# Altium project FMC_DAC_125M_14B_16CHA.PrjPCB (part 2 of 4)

## Sheet power_supply.SchDoc: Shuttler
size 420 x 297 mm; Author: G.Kasprowicz; CompanyName: WUT ISE; DrawnBy: G.Kasprowicz; Organization: WUT ISE; Address1: PW ISE; Address2: Nowowiejska 15/19 00-665 Warsaw; Address3: gkasprow@gmail.com; DocumentNumber: 8; Revision: 1.2; SheetNumber: 8; SheetTotal: 10; ModifiedBy: -; CheckedDate: -; Title2: Power supply; DivGrp: WUT ISE; Designer: G.Kasprowicz; ModifiedDate: -; ProjectName: Sensor Box
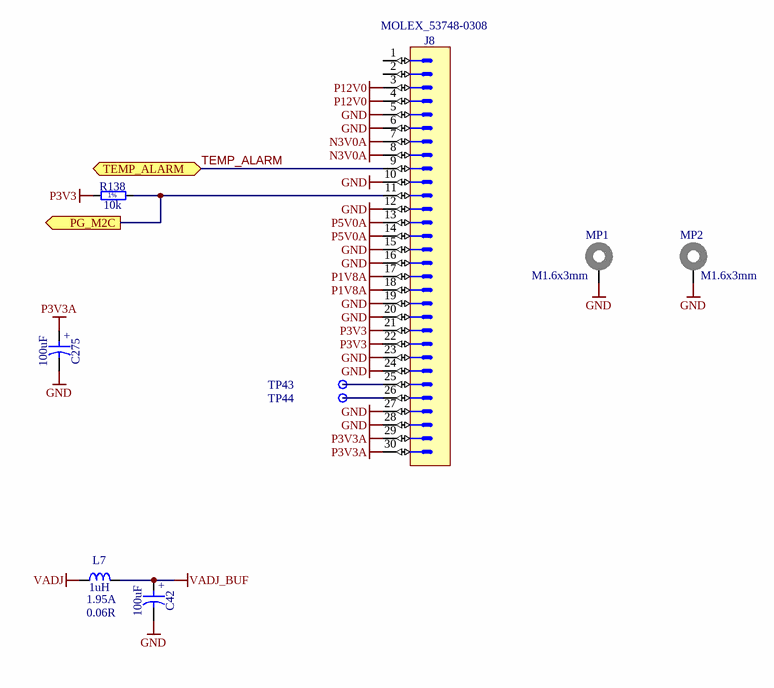
[diagram p3: power_supply.SchDoc]

### Parts
C42  100uF  [CAPMP3216X180N]
C275  100uF  [CAPMP3216X180N]
J8  SlimStack™  [MOLEX_53748-0308]  (value not drawn)
L7  1uH  Power: 1.95A  Resistance: 0.06R  [INDC2620X100N]
MP1  M1.6x3mm  [9774030633]
MP2  M1.6x3mm  [9774030633]
R138  10k  [RESC1005X40N]
TP43  Test Point  [TPS127]  (value not drawn)  (no BOM)
TP44  Test Point  [TPS127]  (value not drawn)  (no BOM)

### Ports
PG_M2C (out), TEMP_ALARM (bidir)

### Nets
GND: C42.2 C275.2 J8.5 J8.6 J8.10 J8.12 J8.15 J8.16 J8.19 J8.20 J8.23 J8.24 J8.27 J8.28 MP1.1 MP2.1
N3V0A: J8.7 J8.8
P1V8A: J8.17 J8.18
P3V3: J8.21 J8.22 R138.1
P3V3A: C275.1 J8.29 J8.30
P5V0A: J8.13 J8.14
P12V0: J8.3 J8.4
VADJ: L7.1
VADJ_BUF: C42.1 L7.2
PG_M2C: J8.11 R138.2 ; port PG_M2C
TEMP_ALARM: J8.9 ; port TEMP_ALARM
NetJ8_25: J8.25 TP43.1
NetJ8_26: J8.26 TP44.1

Not connected (* = marked no-connect by the designer): J8 1 2

### Notes on the sheet
- Project/Equipment
- Document
- Designer
- Drawn by
- Check.by
- Copyright WUT ISE 2018.
  This documentation describes Open Hardware and is licensed under the CERN OHL v.1.1. You may redistribute and modify this documentation under the terms of the CERN OHL v.1.1. (http://ohwr.org/CERNOHL). This documentation is distributed WITHOUT ANY EXPRESS OR IMPLIED WARRANTY, INCLUDING OF MERCHANTABILITY, SATISFACTORY QUALITY AND FITNESS FOR A PARTICULAR PURPOSE. Please see the CERN OHL v.1.1 for applicable conditions.
- Contact
- File
- Last Mod.
- Print Date
- Sheet
- Size
- A3
- of
- Rev
- (in symbol CTE3216-18_100UF_6.3V_20%_ESR0500_AVX_TLJ) +
- (in symbol R0402_10K_1%_0.0625W_100PPM) 1%

### Library data of the parts
C42 C275 = CTE3216-18_100UF_6.3V_20%_ESR0500_AVX_TLJ: Polarised capacitor; Part Description: ESR 0R5 Solid Tantalum Chip Capacitor; Manufacturer: AVX; Manufacturer Part Number: TLJA107M006R0500; Voltage: 6.3V; Tolerance: ±20%; Part Number: CTE3216-18_100UF_6.3V_20%_ESR0500_AVX_TLJ; Component Kind: Standard; Component Type: Standard; Pin Count: 2; Value: 100uF; Status: None; Case: A; Mounted: Yes; Socket: No; SMD: Yes; Sense: No; HelpURL: \\cern.ch\dfs\Applications\Altium\Datasheets\CTE_AVX_TLJ.pdf; Author: CERN DEM JLC; CreateDate: 19.12.2013; LatestRevisionDate: 19.12.2013; ComponentHeight: 1.8mm
J8 = MOLEX_53748-0308: Connector 30 Male; Part Description: 0.50mm Pitch SlimStack™ Dual Row 30 Circuits Surface Mount Vertical Plug (3.00 Stacking Heights); Manufacturer: MOLEX; PressFit: No; Part Number: MOLEX_53748-0308; Component Kind: Standard; Component Type: Standard; Pin Count: 30; Family: SlimStack™; Mounted: Yes; Socket: No; SMD: Yes; Sense: No; Status: None; Manufacturer Part Number: 53748-0308; ComponentHeight: 2.4mm; HelpURL: \\cern.ch\dfs\Applications\Altium\Datasheets\MOLEX_53748-0308.pdf; Author: CERN DEM JLC; CreateDate: 28.08.2012; LatestRevisionDate: 28.08.2012
L7 = IND1008_1UH_20%_WURTH_74479787210B: Inductor; Part Description: Power Multilayer Inductor (WE-PMI Series); Manufacturer: WURTH ELEKTRONIK; Tolerance: ±20%; Part Number: IND1008_1UH_20%_WURTH_74479787210B; Component Kind: Standard; Component Type: Standard; Pin Count: 2; Value: 1uH; Status: None; Manufacturer Part Number: 74479787210B; Mounted: Yes; Socket: No; SMD: Yes; Sense: No; ComponentHeight: 1mm; HelpURL: \\cern.ch\dfs\Applications\Altium\Datasheets\IND_WURTH_WE-PMI_74479787210B.pdf; Author: CERN DEM JLC; CreateDate: 01.10.2014; LatestRevisionDate: 01.10.2014; Case: 1008
MP1 MP2 = 9774030633R: WA-SMSI SMT Steel Spacer, M1.6 Thread Internal, OD 3.3mm, M1.6x3mm; Manufacturer: Wurth Elektronik; Inner Diameter: 1.9mm; Surface: Tin; ComponentLink1Description: Manufacturer; ComponentLink1URL: http://www.we-online.de; ComponentLink2Description: Datasheet; ComponentLink2URL: https://www.we-online.com/catalog/datasheet/9774030633R.pdf; Mounting Technology: SMT; Packaging: Tape and Reel; Manufacturer Part Number: 9774030633R; Length: 3mm; Inner Thread Length: -; Operating Temperature: -55 to +150degC; Outer Diameter: 3.3mm; Published Date: April 2020; Material: Steel; Thread: M1.6
R138 = R0402_10K_1%_0.0625W_100PPM: Resistor - 1%; Part Description: General Purpose Thick Film Chip Resistor; Manufacturer: GENERIC; Manufacturer1 Part Number: 232270671003L; TC: ±100ppm/°C; PressFit: No; Part Number: R0402_10K_1%_0.0625W_100PPM; Component Kind: Standard; Component Type: Standard; Pin Count: 2; Value: 10k; Status: Not Recommended; Power: 0.0625W; Tolerance: ±1%; Manufacturer Part Number: R0402_10K_1%_0.0625W_100PPM; Case: 0402; Mounted: Yes; Sense: No; Socket: No; SMD: Yes; Manufacturer1 Example: YAGEO PHYCOMP; Manufacturer1 ComponentHeight: 0.4mm; HelpURL: \\cern.ch\dfs\Applications\Altium\Datasheets\R0402_Phycomp_RC0402.pdf; Author: CERN DEM JLC; CreateDate: 03.12.2007; LatestRevisionDate: 17.10.2012
TP43 TP44 = SMD_PAD_1.27X1.27MM: Part Description: 1.27mm x 1.27mm PCB Copper Area (SMD Test Point); Mounted: No; Part Number: SMD_PAD_1.27X1.27MM; Component Type: Standard (No BOM); Pin Count: 1; Family: Test Point; Socket: No; SMD: Yes; Sense: No; Status: None; ComponentHeight: 0mm; HelpURL: Undefined; Author: CERN DEM JLC; CreateDate: 12.01.2008; LatestRevisionDate: 12.01.2008; PackageDescription: 1.27mm x 1.27mm PCB Copper Area (SMD Test Point)

## Sheet SAS_Connectors.SchDoc: Shuttler
size 420 x 297 mm; Author: G.Kasprowicz; CompanyName: WUT ISE; DrawnBy: G.Kasprowicz; Organization: WUT ISE; Address1: PW ISE; Address2: Nowowiejska 15/19 00-665 Warsaw; Address3: gkasprow@gmail.com; DocumentNumber: 10; Revision: 1.2; SheetNumber: 10; SheetTotal: 10; ModifiedBy: -; CheckedDate: -; Title2: SAS connectors; DivGrp: WUT ISE; Designer: G.Kasprowicz; ModifiedDate: -; ProjectName: Sensor Box
Used 2 times, as channels U_SAS_Connectors0, U_SAS_Connectors1. Parts and nets are listed once, with the designators drawn on the sheet.
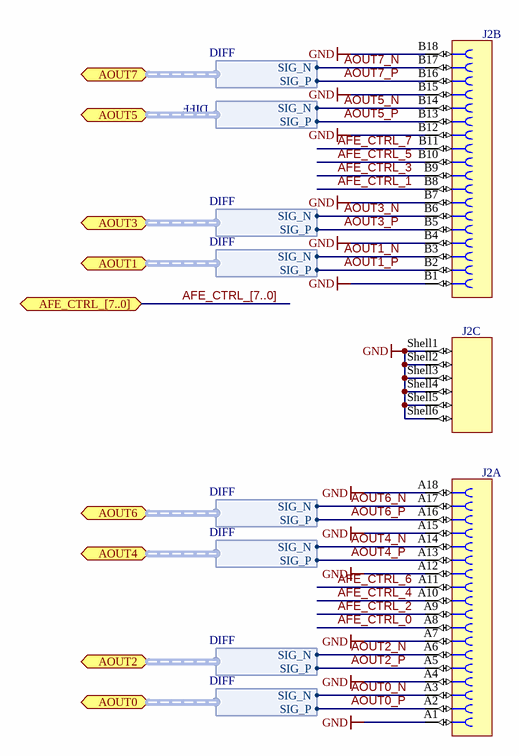
[diagram p4: SAS_Connectors.SchDoc]

### Parts
J2  iPass™  [MOLEX_75783-0107]  (value not drawn)  (parts A,B,C of 3)

### Ports
AFE_CTRL_[7..0] (bidir), AOUT0 (bidir, harness DIFF), AOUT1 (bidir, harness DIFF), AOUT2 (bidir, harness DIFF), AOUT3 (bidir, harness DIFF), AOUT4 (bidir, harness DIFF), AOUT5 (bidir, harness DIFF), AOUT6 (bidir, harness DIFF), AOUT7 (bidir, harness DIFF)

### Harnesses
DIFF: SIG_P, SIG_N

### Nets
GND: J2.A1 J2.A4 J2.A7 J2.A12 J2.A15 J2.A18 J2.B1 J2.B4 J2.B7 J2.B12 J2.B15 J2.B18 J2.Shell1 J2.Shell2 J2.Shell3 J2.Shell4 J2.Shell5 J2.Shell6
AFE_CTRL_0: J2.A8
AFE_CTRL_1: J2.B8
AFE_CTRL_2: J2.A9
AFE_CTRL_3: J2.B9
AFE_CTRL_4: J2.A10
AFE_CTRL_5: J2.B10
AFE_CTRL_6: J2.A11
AFE_CTRL_7: J2.B11
AOUT0_N: J2.A3 ; port AOUT0.SIG_N
AOUT0_P: J2.A2 ; port AOUT0.SIG_P
AOUT1_N: J2.B3 ; port AOUT1.SIG_N
AOUT1_P: J2.B2 ; port AOUT1.SIG_P
AOUT2_N: J2.A6 ; port AOUT2.SIG_N
AOUT2_P: J2.A5 ; port AOUT2.SIG_P
AOUT3_N: J2.B6 ; port AOUT3.SIG_N
AOUT3_P: J2.B5 ; port AOUT3.SIG_P
AOUT4_N: J2.A14 ; port AOUT4.SIG_N
AOUT4_P: J2.A13 ; port AOUT4.SIG_P
AOUT5_N: J2.B14 ; port AOUT5.SIG_N
AOUT5_P: J2.B13 ; port AOUT5.SIG_P
AOUT6_N: J2.A17 ; port AOUT6.SIG_N
AOUT6_P: J2.A16 ; port AOUT6.SIG_P
AOUT7_N: J2.B17 ; port AOUT7.SIG_N
AOUT7_P: J2.B16 ; port AOUT7.SIG_P

### Channels
U_SAS_Connectors0: designators end in A
U_SAS_Connectors1: designators end in B

### Buses and harness runs
bus AFE_CTRL_[7..0] = port AFE_CTRL_[7..0]

### Notes on the sheet
- Project/Equipment
- Document
- Designer
- Drawn by
- Check.by
- Copyright WUT ISE 2018.
  This documentation describes Open Hardware and is licensed under the CERN OHL v.1.1. You may redistribute and modify this documentation under the terms of the CERN OHL v.1.1. (http://ohwr.org/CERNOHL). This documentation is distributed WITHOUT ANY EXPRESS OR IMPLIED WARRANTY, INCLUDING OF MERCHANTABILITY, SATISFACTORY QUALITY AND FITNESS FOR A PARTICULAR PURPOSE. Please see the CERN OHL v.1.1 for applicable conditions.
- Contact
- File
- Last Mod.
- Print Date
- Sheet
- Size
- A3
- of
- Rev

### Library data of the parts
J2 = MOLEX_75783-0107: 36 Circuit, Right Angle , Internal Assembly, iPass™ I/O Surface Mount Receptacle with Left Key Shell; Part Number: MOLEX 75783-0107 / 75783-0136; Manufacturer: MOLEX; Manufacturer Part Number: 75783-0107 / 75783-0136; PressFit: No; Component Kind: Standard; Component Type: Standard; Pin Count: 42; Family: iPass™; Mounted: Yes; Socket: No; SMD: Yes; Sense: No; Status: None; Part Description: 36 Circuit, Right Angle , Internal Assembly, iPass™ I/O Surface Mount Receptacle with Left Key Shell; ComponentHeight: 8.47mm; HelpURL: \\cern.ch\dfs\Applications\Altium\Datasheets\MOLEX_75783-0107.pdf; Author: CERN DEM JLC; CreateDate: 12.11.2014; LatestRevisionDate: 12.11.2014

## Sheet DAC_AFE.SchDoc: Shuttler
size 420 x 297 mm; Author: G.Kasprowicz; CompanyName: WUT ISE; DrawnBy: G.Kasprowicz; Organization: WUT ISE; Address1: PW ISE; Address2: Nowowiejska 15/19 00-665 Warsaw; Address3: gkasprow@gmail.com; DocumentNumber: 4; Revision: 1.2; SheetNumber: 4; SheetTotal: 10; ModifiedBy: -; CheckedDate: -; Title2: DAC AFE; DivGrp: WUT ISE; Designer: G.Kasprowicz; ModifiedDate: -; ProjectName: Sensor Box
Used 16 times, as channels U_DAC_AFE0, U_DAC_AFE1, U_DAC_AFE2, U_DAC_AFE3, U_DAC_AFE4, U_DAC_AFE5, U_DAC_AFE6, U_DAC_AFE7, U_DAC_AFE8, U_DAC_AFE9, U_DAC_AFE10, U_DAC_AFE11, U_DAC_AFE12, U_DAC_AFE13, U_DAC_AFE14, U_DAC_AFE15. Parts and nets are listed once, with the designators drawn on the sheet.
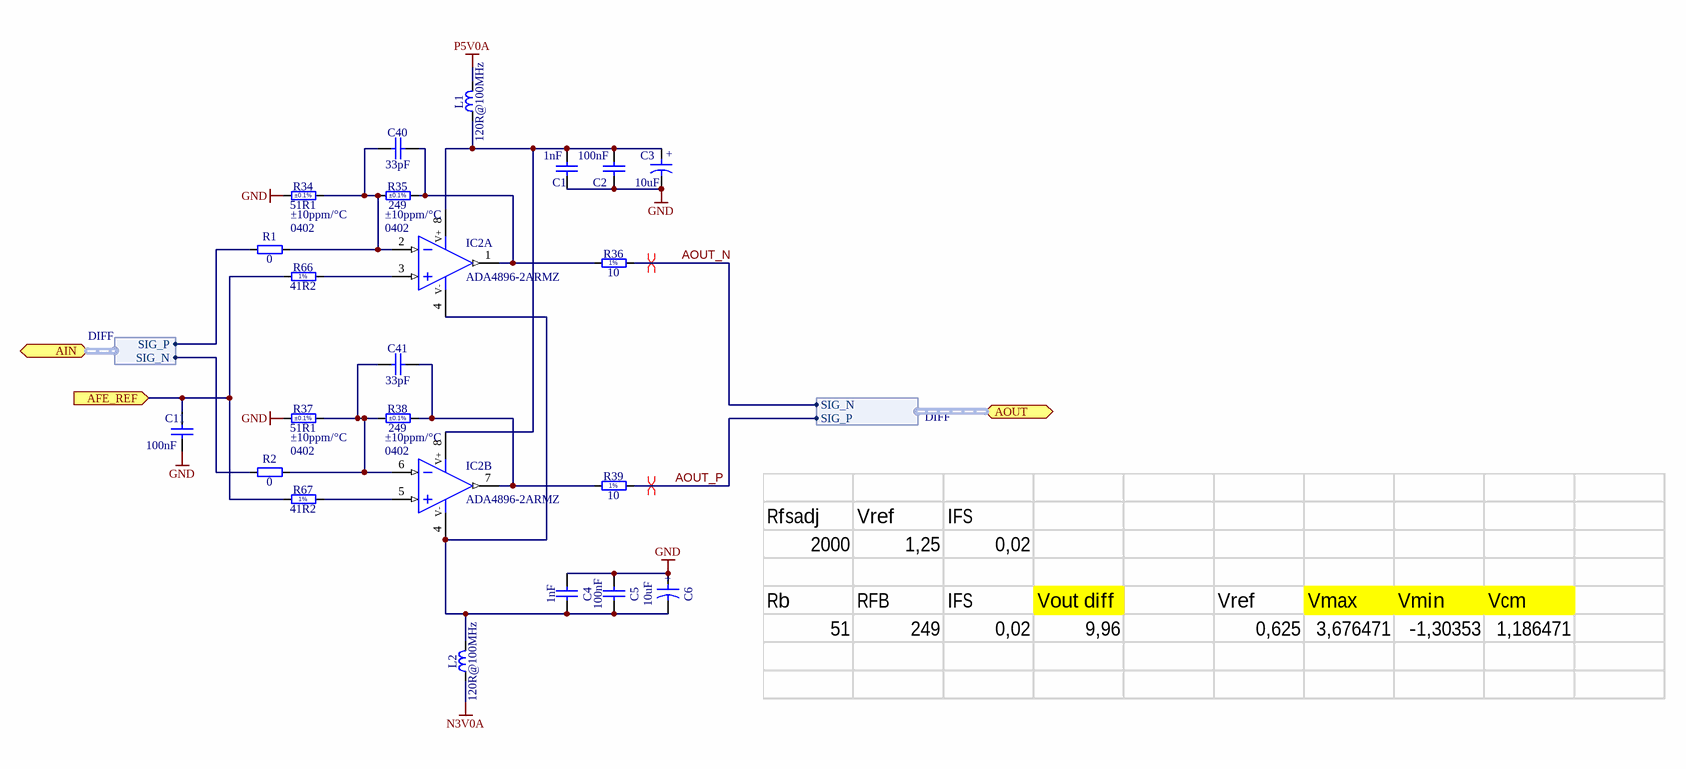
[diagram p5: DAC_AFE.SchDoc]

### Parts
C1  1nF  [CAPC0603X33N]
C2  100nF  [CAPC0603X33N]
C3  10uF  [CAPMP3216X180N]
C4  1nF  [CAPC0603X33N]
C5  100nF  [CAPC0603X33N]
C6  10uF  [CAPMP3216X180N]
C11  100nF  [CAPC0603X33N]
C40  33pF  [CAPC1005X61N]
C41  33pF  [CAPC1005X61N]
IC2  ADA4896-2ARMZ  [SOP65P490X110-8N]  (parts A,B of 2)
L1  120R@100MHz  [INDC1608X95N]
L2  120R@100MHz  [INDC1608X95N]
R1  0  [RESC0603X28N]
R2  0  [RESC0603X28N]
R34  51R1  TC: ±10ppm/°C  Case: 0402  Tolerance: ±0.1%  [RESC1005X35N]
R35  249  TC: ±10ppm/°C  Case: 0402  Tolerance: ±0.1%  [RESC1005X35N]
R36  10  [RESC1005X40N]
R37  51R1  TC: ±10ppm/°C  Case: 0402  Tolerance: ±0.1%  [RESC1005X35N]
R38  249  TC: ±10ppm/°C  Case: 0402  Tolerance: ±0.1%  [RESC1005X35N]
R39  10  [RESC1005X40N]
R66  41R2  [RESC0603X28N]
R67  41R2  [RESC0603X28N]

### Ports
AFE_REF (in), AIN (bidir, harness DIFF), AOUT (bidir, harness DIFF)

### Harnesses
DIFF: SIG_P, SIG_N

### Nets
GND: C1.2 C2.2 C3.2 C4.2 C5.2 C6.1 C11.2 R34.1 R37.1
N3V0A: L2.1
P5V0A: L1.2
AFE_REF: C11.1 R66.1 R67.1 ; port AFE_REF
AOUT_N: R36.2 ; port AOUT.SIG_N
AOUT_P: R39.2 ; port AOUT.SIG_P
NetC1_1: C1.1 C2.1 C3.1 IC2.8(V+) L1.1
NetC4_1: C4.1 C5.1 C6.2 IC2.4(V-) L2.2
NetC40_1: C40.1 IC2.2(IN-) R1.2 R34.2 R35.1
NetC40_2: C40.2 IC2.1(OUT) R35.2 R36.1
NetC41_1: C41.1 IC2.6(IN-) R2.2 R37.2 R38.1
NetC41_2: C41.2 IC2.7(OUT) R38.2 R39.1
NetIC2_3: IC2.3(IN+) R66.2
NetIC2_5: IC2.5(IN+) R67.2
NetR1_1: R1.1 ; port AIN.SIG_P
NetR2_1: R2.1 ; port AIN.SIG_N

### Channels
U_DAC_AFE0: designators end in A; ports AFE_REF=AFE_REF
U_DAC_AFE1: designators end in B; ports AFE_REF=AFE_REF
U_DAC_AFE2: designators end in C; ports AFE_REF=AFE_REF
U_DAC_AFE3: designators end in D; ports AFE_REF=AFE_REF
U_DAC_AFE4: designators end in E; ports AFE_REF=AFE_REF
U_DAC_AFE5: designators end in F; ports AFE_REF=AFE_REF
U_DAC_AFE6: designators end in G; ports AFE_REF=AFE_REF
U_DAC_AFE7: designators end in H; ports AFE_REF=AFE_REF
U_DAC_AFE8: designators end in I; ports AFE_REF=AFE_REF
U_DAC_AFE9: designators end in J; ports AFE_REF=AFE_REF
U_DAC_AFE10: designators end in K; ports AFE_REF=AFE_REF
U_DAC_AFE11: designators end in L; ports AFE_REF=AFE_REF
U_DAC_AFE12: designators end in M; ports AFE_REF=AFE_REF
U_DAC_AFE13: designators end in N; ports AFE_REF=AFE_REF
U_DAC_AFE14: designators end in O; ports AFE_REF=AFE_REF
U_DAC_AFE15: designators end in P; ports AFE_REF=AFE_REF

### Layout directives
differential pair; differential pair class V_analog: AOUT0_N, AOUT0_P

### Notes on the sheet
- Project/Equipment
- Document
- Designer
- Drawn by
- Check.by
- Copyright WUT ISE 2018.
  This documentation describes Open Hardware and is licensed under the CERN OHL v.1.1. You may redistribute and modify this documentation under the terms of the CERN OHL v.1.1. (http://ohwr.org/CERNOHL). This documentation is distributed WITHOUT ANY EXPRESS OR IMPLIED WARRANTY, INCLUDING OF MERCHANTABILITY, SATISFACTORY QUALITY AND FITNESS FOR A PARTICULAR PURPOSE. Please see the CERN OHL v.1.1 for applicable conditions.
- Contact
- File
- Last Mod.
- Print Date
- Sheet
- Size
- A3
- of
- Rev
- (in symbol CTE3216-18_10UF_10V_10%_LESR1800) +
- (in symbol R0402_10R_1%_0.0625W_200PPM) 1%
- (in symbol RES_0201_41R2_1%_200ppm) 1%

### Library data of the parts
C1 C4 = CC0201_1NF_16V_10%_X5R: Non-polarised capacitor; Part Description: SMD Multilayer Chip Ceramic Capacitor; Manufacturer: GENERIC; Manufacturer1 Part Number: 0201YD102KAT2A; Voltage: 16V; TC: X5R; Tolerance: ±10%; Part Number: CC0201_1NF_16V_10%_X5R; Component Kind: Standard; Component Type: Standard; Pin Count: 2; Value: 1nF; Status: Not Recommended; Manufacturer Part Number: CC0201_1NF_16V_10%_X5R; Case: 0201; Mounted: Yes; Socket: No; SMD: Yes; Sense: No; Manufacturer1 Example: AVX; Manufacturer1 ComponentHeight: 0.33mm; HelpURL: \\cern.ch\dfs\Applications\Altium\Datasheets\CC0201_X5R_AVX.pdf; Author: CERN DEM JLC; CreateDate: 03.12.2007; LatestRevisionDate: 03.12.2007
C2 C5 C11 = CC0201_100NF_6.3V_10%_X5R: Non-polarised capacitor; Part Description: SMD Multilayer Chip Ceramic Capacitor; Manufacturer: GENERIC; Manufacturer1 Part Number: 02016D104KAT2A; Voltage: 6.3V; TC: X5R; Tolerance: ±10%; Part Number: CC0201_100NF_6.3V_10%_X5R; Component Kind: Standard; Component Type: Standard; Pin Count: 2; Value: 100nF; Status: Not Recommended; Manufacturer Part Number: CC0201_100NF_6.3V_10%_X5R; Case: 0201; Mounted: Yes; Socket: No; SMD: Yes; Sense: No; Manufacturer1 Example: AVX; Manufacturer1 ComponentHeight: 0.33mm; HelpURL: \\cern.ch\dfs\Applications\Altium\Datasheets\CC0201_X5R_AVX.pdf; Author: CERN DEM JLC; CreateDate: 03.12.2007; LatestRevisionDate: 03.12.2007
C3 C6 = CTE3216-18_10UF_10V_10%_LESR1800: Polarised capacitor; Part Description: Low ESR 1R8 Solid Tantalum Chip Capacitor; Manufacturer: GENERIC; Manufacturer1 Part Number: TPSA106K010R1800; Voltage: 10V; Tolerance: ±10%; Part Number: CTE3216-18_10UF_10V_10%_LESR1800; Component Kind: Standard; Component Type: Standard; Pin Count: 2; Value: 10uF; Status: Preferred; Manufacturer Part Number: CTE3216-18_10UF_10V_10%_LESR1800; Case: A; Mounted: Yes; Socket: No; SMD: Yes; Sense: No; Manufacturer1 Example: AVX; Manufacturer1 ComponentHeight: 1.8mm; HelpURL: \\cern.ch\dfs\Applications\Altium\Datasheets\CTE-LESR_AVX_TPS.pdf; Author: CERN DEM JLC; CreateDate: 05.05.2008; LatestRevisionDate: 20.01.2009
C40 C41 = CC0402_33PF_50V_1%_NP0_JOHANSON_R07S: Non-polarised capacitor; Part Description: Ultra High-Q SMD Multilayer Capacitor; Manufacturer: JOHANSON TECHNOLOGY; Manufacturer Part Number: 500R07S330FV4T; Voltage: 50V; TC: C0G/NP0; Tolerance: ±1%; Part Number: CC0402_33PF_50V_1%_NP0_JOHANSON_R07S; Component Kind: Standard; Component Type: Standard; Pin Count: 2; Value: 33pF; Status: Not Recommended; Case: 0402; Mounted: Yes; Socket: No; SMD: Yes; Sense: No; ComponentHeight: 0.61mm; HelpURL: \\cern.ch\dfs\Applications\Altium\Datasheets\CC0402_NP0_JOHANSON_R07S.pdf; Author: CERN DEM BC; CreateDate: 20.11.2017; LatestRevisionDate: 26.09.2018
IC2 = ADA4896-2ARMZ: Dual Operational Amplifier; Part Description: 1 nV/sqrt Hz, Low Power, Rail-to-Rail Output Amplifiers; Manufacturer: ANALOG DEVICES; PressFit: No; Bonding: No; Part Number: ADA4896-2ARMZ; Component Kind: Standard; Component Type: Standard; Device: ADA4896-2ARMZ; PackageDescription: SOP, 0.65mm Pitch; 8 Pin, 3.00mm W X 3.00mm L X 1.10mm H body, IPC Medium Density; Manufacturer Part Number: ADA4896-2ARMZ; Pin Count: 8; Case: MSOP8; Mounted: Yes; Socket: No; SMD: Yes; Sense: No; ComponentHeight: 1.1mm; Author: CERN DEM MR; HelpURL: \\cern.ch\dfs\Applications\Altium\Datasheets\ADA4896-2ARMZ.pdf; CreateDate: 27/04/2016; LatestRevisionDate: 08/11/2017
L1 L2 = IND0603_MURATA_BLM18PG121SN1D: Inductor; Part Description: SMD EMIFIL Chip Ferrite Bead; Manufacturer: MURATA; Power: 2A; Resistance: 0.05R; Part Number: IND0603_MURATA_BLM18PG121SN1D; Component Kind: Standard; Component Type: Standard; Pin Count: 2; Value: 120R@100MHz; Status: None; Manufacturer Part Number: BLM18PG121SN1D; Case: 0603; Mounted: Yes; Socket: No; SMD: Yes; Sense: No; ComponentHeight: 0.95mm; HelpURL: \\cern.ch\dfs\Applications\Altium\Datasheets\IND0603_MURATA_BLM18P.pdf; Author: CERN DEM BC; CreateDate: 27.07.2015; LatestRevisionDate: 27.07.2015
R1 R2 = R0201_0R_JUMPER: Resistor; Part Description: 1A (0.05R Max DC Resistance) Zero Ohm Jumper; Manufacturer: GENERIC; Manufacturer1 Part Number: CRCW02010000Z0ED; PressFit: No; Part Number: R0201_0R_JUMPER; Component Kind: Standard; Component Type: Standard; Pin Count: 2; Value: 0; Status: Not Recommended; Manufacturer Part Number: R0201_0R_JUMPER; Case: 0201; Mounted: Yes; Sense: No; Socket: No; SMD: Yes; Manufacturer1 Example: VISHAY; Manufacturer1 ComponentHeight: 0.27mm; HelpURL: \\cern.ch\dfs\Applications\Altium\Datasheets\R0201_VISHAY_CRCW e3.pdf; Author: CERN DEM JLC; CreateDate: 19.11.2014; LatestRevisionDate: 08.01.2015
R34 R37 = RES_0402_51R1_0.1%_10ppm: Resistor - 0.1%; Part Number: R_0402_51R1_0.1%_10ppm; Part Description: Thin Film Precision Resistor; Manufacturer: GENERIC; Manufacturer1 Part Number: RQ73C1E51R1BTD; Power: 1/16W; PressFit: No; Component Kind: Standard; Component Type: Standard; Pin Count: 2; Value: 51R1; Status: Recommended; Manufacturer Part Number: R_0402_51R1_0.1%_10ppm; Mounted: Yes; Sense: No; Socket: No; SMD: Yes; Manufacturer1 Example: TE CONNECTIVITY; Manufacturer1 ComponentHeight: 0.35mm; HelpURL: \\cern.ch\dfs\Applications\Altium\Datasheets\R0402_TYCO_CPF.pdf; Author: GK; CreateDate: 22.09.2015; LatestRevisionDate: 22.09.2015
R35 R38 = RES_0402_249R_0.1%_10ppm: Resistor - 0.1%; Part Number: R_0402_249R_0.1%_10ppm; Part Description: Thin Film Precision Resistor; Manufacturer: GENERIC; Manufacturer1 Part Number: RQ73C1E249RBTD; Power: 1/16W; PressFit: No; Component Kind: Standard; Component Type: Standard; Pin Count: 2; Value: 249; Status: Recommended; Manufacturer Part Number: R_0402_249R_0.1%_10ppm; Mounted: Yes; Sense: No; Socket: No; SMD: Yes; Manufacturer1 Example: TE CONNECTIVITY; Manufacturer1 ComponentHeight: 0.35mm; HelpURL: \\cern.ch\dfs\Applications\Altium\Datasheets\R0402_TYCO_CPF.pdf; Author: GK; CreateDate: 22.09.2015; LatestRevisionDate: 22.09.2015
R36 R39 = R0402_10R_1%_0.0625W_200PPM: Resistor - 1%; Part Description: General Purpose Thick Film Chip Resistor; Manufacturer: GENERIC; Manufacturer1 Part Number: 232270671009L; TC: ±200ppm/°C; PressFit: No; Part Number: R0402_10R_1%_0.0625W_200PPM; Component Kind: Standard; Component Type: Standard; Pin Count: 2; Value: 10; Status: Not Recommended; Power: 0.0625W; Tolerance: ±1%; Manufacturer Part Number: R0402_10R_1%_0.0625W_200PPM; Case: 0402; Mounted: Yes; Sense: No; Socket: No; SMD: Yes; Manufacturer1 Example: YAGEO PHYCOMP; Manufacturer1 ComponentHeight: 0.4mm; HelpURL: \\cern.ch\dfs\Applications\Altium\Datasheets\R0402_Phycomp_RC0402.pdf; Author: CERN DEM JLC; CreateDate: 24/06/2009; LatestRevisionDate: 17/10/2012
R66 R67 = RES_0201_41R2_1%_200ppm: 41R2k, 0201, 1%; Part Number: R0201_41R2_1%_200ppm; Part Description: Thick Film Chip Resistor; Manufacturer: GENERIC; Manufacturer Part Number: RES0201_41R2_1%_200ppm; Manufacturer1 Part Number: RC0201FR-0741R2L; Power: 0.05W; TC: ±200ppm/°C; Table: Resistors SMD; Component Kind: Standard; Component Type: Standard; Pin Count: 2; Value: 41R2; Status: Not recommended; Tolerance: ±1%; Case: 0201; Mounted: Yes; Socket: No; SMD: Yes; Manufacturer1 Example: Yaego; Manufacturer1 ComponentHeight: 0.27mm; HelpURL: \\cern.ch\dfs\Applications\Altium\Datasheets\R0201_VISHAY_CRCW e3.pdf; Author: GK; CreateDate: 2014-11-13; LatestRevisionDate: 2014-11-13

## Sheet DACs.SchDoc: Shuttler
size 420 x 297 mm; Author: G.Kasprowicz; CompanyName: WUT ISE; DrawnBy: G.Kasprowicz; Organization: WUT ISE; Address1: PW ISE; Address2: Nowowiejska 15/19 00-665 Warsaw; Address3: gkasprow@gmail.com; DocumentNumber: 5; Revision: 1.2; SheetNumber: 5; SheetTotal: 10; ModifiedBy: -; CheckedDate: -; Title2: DAC; DivGrp: WUT ISE; Designer: G.Kasprowicz; ModifiedDate: -; ProjectName: Sensor Box
Used 8 times, as channels U_DACs0, U_DACs1, U_DACs2, U_DACs3, U_DACs4, U_DACs5, U_DACs6, U_DACs7. Parts and nets are listed once, with the designators drawn on the sheet.
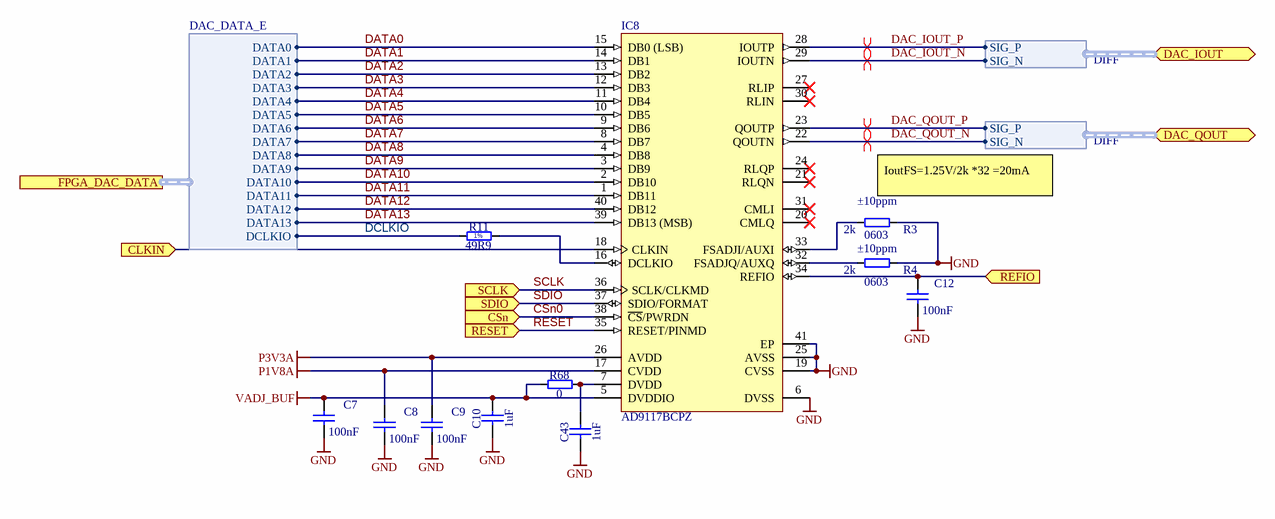
[diagram p6: DACs.SchDoc]

### Parts
C7  100nF  [CAPC1005X55N]
C8  100nF  [CAPC1005X55N]
C9  100nF  [CAPC1005X55N]
C10  1uF  [CAPC1608X87N]
C12  100nF  [CAPC1005X55N]
C43  1uF  [CAPC1608X87N]
IC8  AD9117BCPZ  [CP-40-1_N]
R3  2k  TC: ±10ppm  Case: 0603  [RESC1608X55N]
R4  2k  TC: ±10ppm  Case: 0603  [RESC1608X55N]
R11  49R9  [RESC0603X28N]
R68  0  [RESC1005X40N]

### Ports
CLKIN (in), CSn (in), DAC_IOUT (bidir, harness DIFF), DAC_QOUT (bidir, harness DIFF), FPGA_DAC_DATA (harness DAC_DATA_E), REFIO (in), RESET (in), SCLK (in), SDIO (in)

### Harnesses
DIFF: SIG_P, SIG_N
DAC_DATA_E: DATA0, DATA1, DATA2, DATA3, DATA4, DATA5, DATA6, DATA7, DATA8, DATA9, DATA10, DATA11, DATA12, DATA13, DCLKIO

### Nets
GND: C7.2 C8.2 C9.2 C10.1 C12.2 C43.1 IC8.6(DVSS) IC8.19(CVSS) IC8.25(AVSS) IC8.41(EP) R3.2 R4.2
P1V8A: C8.1 IC8.17(CVDD)
P3V3A: C9.1 IC8.26(AVDD)
VADJ_BUF: C7.1 C10.2 IC8.5(DVDDIO) R68.1
CLKIN: IC8.18(CLKIN) ; port CLKIN
CSn0: IC8.38(~{CS}/PWRDN) ; port CSn
DAC_IOUT_N: IC8.29(IOUTN) ; port DAC_IOUT.SIG_N
DAC_IOUT_P: IC8.28(IOUTP) ; port DAC_IOUT.SIG_P
DAC_QOUT_N: IC8.22(QOUTN) ; port DAC_QOUT.SIG_N
DAC_QOUT_P: IC8.23(QOUTP) ; port DAC_QOUT.SIG_P
DATA0: IC8.15(DB0_(LSB)) ; port FPGA_DAC_DATA.DATA0
DATA1: IC8.14(DB1) ; port FPGA_DAC_DATA.DATA1
DATA2: IC8.13(DB2) ; port FPGA_DAC_DATA.DATA2
DATA3: IC8.12(DB3) ; port FPGA_DAC_DATA.DATA3
DATA4: IC8.11(DB4) ; port FPGA_DAC_DATA.DATA4
DATA5: IC8.10(DB5) ; port FPGA_DAC_DATA.DATA5
DATA6: IC8.9(DB6) ; port FPGA_DAC_DATA.DATA6
DATA7: IC8.8(DB7) ; port FPGA_DAC_DATA.DATA7
DATA8: IC8.4(DB8) ; port FPGA_DAC_DATA.DATA8
DATA9: IC8.3(DB9) ; port FPGA_DAC_DATA.DATA9
DATA10: IC8.2(DB10) ; port FPGA_DAC_DATA.DATA10
DATA11: IC8.1(DB11) ; port FPGA_DAC_DATA.DATA11
DATA12: IC8.40(DB12) ; port FPGA_DAC_DATA.DATA12
DATA13: IC8.39(DB13_(MSB)) ; port FPGA_DAC_DATA.DATA13
DCLKIO: R11.1 ; port FPGA_DAC_DATA.DCLKIO
REFIO: C12.1 IC8.34(REFIO) ; port REFIO
RESET: IC8.35(RESET/PINMD) ; port RESET
SCLK: IC8.36(SCLK/CLKMD) ; port SCLK
SDIO: IC8.37(SDIO/FORMAT) ; port SDIO
NetC43_2: C43.2 IC8.7(DVDD) R68.2
NetIC8_16: IC8.16(DCLKIO) R11.2
NetIC8_32: IC8.32(FSADJQ/AUXQ) R4.1
NetIC8_33: IC8.33(FSADJI/AUXI) R3.1

Not connected (* = marked no-connect by the designer): IC8 20(CMLQ)* 21(RLQN)* 24(RLQP)* 27(RLIP)* 30(RLIN)* 31(CMLI)*

### Channels
U_DACs0: designators end in A; ports CLKIN=DAC_CLK0 CSn=CSn0 REFIO=DAC_REF RESET=HB16_P SCLK=HB16_N SDIO=HB06_CC_N
U_DACs1: designators end in B; ports CLKIN=DAC_CLK1 CSn=CSn0 REFIO=DAC_REF RESET=HB16_P SCLK=HB16_N SDIO=HB06_CC_N
U_DACs2: designators end in C; ports CLKIN=DAC_CLK2 CSn=CSn0 REFIO=DAC_REF RESET=HB16_P SCLK=HB16_N SDIO=HB06_CC_N
U_DACs3: designators end in D; ports CLKIN=DAC_CLK3 CSn=CSn0 REFIO=DAC_REF RESET=HB16_P SCLK=HB16_N SDIO=HB06_CC_N
U_DACs4: designators end in E; ports CLKIN=DAC_CLK4 CSn=CSn0 REFIO=DAC_REF RESET=HB16_P SCLK=HB16_N SDIO=HB06_CC_N
U_DACs5: designators end in F; ports CLKIN=DAC_CLK5 CSn=CSn0 REFIO=DAC_REF RESET=HB16_P SCLK=HB16_N SDIO=HB06_CC_N
U_DACs6: designators end in G; ports CLKIN=DAC_CLK6 CSn=CSn0 REFIO=DAC_REF RESET=HB16_P SCLK=HB16_N SDIO=HB06_CC_N
U_DACs7: designators end in H; ports CLKIN=DAC_CLK7 CSn=CSn0 REFIO=DAC_REF RESET=HB16_P SCLK=HB16_N SDIO=HB06_CC_N

### Layout directives
differential pair: DAC_IOUT_N, DAC_IOUT_P, DAC_QOUT_N, DAC_QOUT_P

### Notes on the sheet
- (near R3) IoutFS=1.25V/2k *32 =20mA
- Project/Equipment
- Document
- Designer
- Drawn by
- Check.by
- Copyright WUT ISE 2018.
  This documentation describes Open Hardware and is licensed under the CERN OHL v.1.1. You may redistribute and modify this documentation under the terms of the CERN OHL v.1.1. (http://ohwr.org/CERNOHL). This documentation is distributed WITHOUT ANY EXPRESS OR IMPLIED WARRANTY, INCLUDING OF MERCHANTABILITY, SATISFACTORY QUALITY AND FITNESS FOR A PARTICULAR PURPOSE. Please see the CERN OHL v.1.1 for applicable conditions.
- Contact
- File
- Last Mod.
- Print Date
- Sheet
- Size
- A3
- of
- Rev
- (in symbol R0201_49R9_1%_0.05W_200PPM) 1%

### Library data of the parts
C7-C9 C12 = CC0402_100NF_16V_10%_X7R: Non-polarised capacitor; Part Description: SMD Multilayer Chip Ceramic Capacitor; Manufacturer: GENERIC; Manufacturer1 Part Number: GRM155R71C104KA88D; Voltage: 16V; TC: X7R; Tolerance: ±10%; Table: Capacitors SMD; Part Number: CC0402_100NF_16V_10%_X7R; Component Kind: Standard; Component Type: Standard; Pin Count: 2; Value: 100nF; Status: Not Recommended; Manufacturer Part Number: CC0402_100NF_16V_10%_X7R; Case: 0402; Mounted: Yes; Socket: No; SMD: Yes; Manufacturer1 Example: MURATA; Manufacturer1 ComponentHeight: 0.55mm; HelpURL: \\cern.ch\dfs\Applications\Altium\Datasheets\CC0402_X7R_MURATA_GRM.pdf; Author: CERN DEM JLC; CreateDate: 2013-12-05; LatestRevisionDate: 2007-12-03
C10 C43 = CC0603_1UF_25V_10%_X7R: Non-polarised capacitor; Part Description: SMD Multilayer Chip Ceramic Capacitor; Manufacturer: GENERIC; Manufacturer1 Part Number: GRM188R71E105KA12D; Voltage: 25V; TC: X7R; Tolerance: ±10%; Part Number: CC0603_1UF_25V_10%_X7R; Component Kind: Standard; Component Type: Standard; Pin Count: 2; Value: 1uF; Status: None; Manufacturer Part Number: CC0603_1UF_25V_10%_X7R; Case: 0603; Mounted: Yes; Socket: No; SMD: Yes; Sense: No; Manufacturer1 Example: MURATA; Manufacturer1 ComponentHeight: 0.9mm; HelpURL: \\cern.ch\dfs\Applications\Altium\Datasheets\CC0603_X7R_MURATA.pdf; Author: CERN DEM JLC; CreateDate: 18/01/2011; LatestRevisionDate: 18/01/2011
IC8 = CMP-0318-00565-2: Dual 14-Bit Low Power TxDAC Digital-to-Analog Converter, 0 to +70 degC, CP-40-1, Pb-Free, Tray; Manufacturer: Analog Devices; Generic Part Number: AD9117; Max V+: 3.3V; Single Supply: Yes; # DAC Outputs: 2; Resolution (Bits): 14; ComponentLink4Description: Product URL; ComponentLink2URL: http://www.analog.com/static/imported-files/data_sheets/AD9114_9115_9116_9117.pdf; Packing: Tray; PackageDescription: 40-Pin Lead Frame Chip Scale Package [LFCSP_VQ] Very Thin Quad; PackageVersion: Oct-2006; ComponentLink1URL: http://www.analog.com/en/index.html; Mounting Technology: Surface Mount; ComponentLink5URL: http://www.analog.com/en/digital-to-analog-converters/da-converters/ad9117/products/product.html#prod_cross_sell; ComponentLink3Description: Package Specification; PartNumber: AD9117BCPZ; PackageReference: CP-40-1; ComponentLink1Description: Manufacturer URL; ComponentLink4URL: http://www.analog.com/en/digital-to-analog-converters/da-converters/ad9117/products/product.html; ComponentLink3URL: http://www.analog.com/static/imported-files/packages/PKG_PDF/LFCSP(CP)/CP_40_1.pdf; ComponentLink2Description: Datasheet; ComponentLink5Description: Reference Design URL; Code_JEDEC: MO-220-VJJD-2; RoHS: Y; RevisionNote: Component URL fixed; DatasheetVersion: Rev.B
R3 R4 = R0603_2K_0.1%_0.063W_10PPM: Resistor - 0.1%; Part Description: Thin Film Chip Resistor; Manufacturer: GENERIC; Manufacturer1 Part Number: RN73C1J2K0BTDF; Power: 0.063W; PressFit: No; Part Number: R0603_2K_0.1%_0.063W_10PPM; Component Kind: Standard; Component Type: Standard; Pin Count: 2; Value: 2k; Status: Not Recommended; Tolerance: ±0.1%; Manufacturer Part Number: R0603_2K_0.1%_0.063W_10PPM; Mounted: Yes; Sense: No; Socket: No; SMD: Yes; Manufacturer1 Example: TYCO HOLSWORTHY; Manufacturer1 ComponentHeight: 0.5mm; HelpURL: \\cern.ch\dfs\Applications\Altium\Datasheets\R0603_Tyco_RN73.pdf; Author: CERN DEM JLC; CreateDate: 03.12.2007; LatestRevisionDate: 13.03.2008
R11 = R0201_49R9_1%_0.05W_200PPM: Resistor - 1%; Part Description: Thick Film Chip Resistor; Manufacturer: GENERIC; Manufacturer1 Part Number: CRCW020149R9FNED; Power: 0.05W; TC: ±200ppm/°C; PressFit: No; Part Number: R0201_49R9_1%_0.05W_200PPM; Component Kind: Standard; Component Type: Standard; Pin Count: 2; Value: 49R9; Status: Not Recommended; Tolerance: ±1%; Manufacturer Part Number: R0201_49R9_1%_0.05W_200PPM; Case: 0201; Mounted: Yes; Sense: No; Socket: No; SMD: Yes; Manufacturer1 Example: VISHAY; Manufacturer1 ComponentHeight: 0.27mm; HelpURL: \\cern.ch\dfs\Applications\Altium\Datasheets\R0201_VISHAY_CRCW e3.pdf; Author: CERN DEM BC; CreateDate: 10/01/2020; LatestRevisionDate: 10/01/2020
R68 = R0402_0R_JUMPER: Resistor; Part Description: 1A (0.05R Max DC Resistance) Zero Ohm Jumper; Manufacturer: GENERIC; Manufacturer1 Part Number: 232270591001L; PressFit: No; Part Number: R0402_0R_JUMPER; Component Kind: Standard; Component Type: Standard; Pin Count: 2; Value: 0; Status: Not Recommended; Manufacturer Part Number: R0402_0R_JUMPER; Case: 0402; Mounted: Yes; Sense: No; Socket: No; SMD: Yes; Manufacturer1 Example: YAGEO PHYCOMP; Manufacturer1 ComponentHeight: 0.4mm; HelpURL: \\cern.ch\dfs\Applications\Altium\Datasheets\R0402_Phycomp_RC0402.pdf; Author: CERN DEM JLC; CreateDate: 03.12.2007; LatestRevisionDate: 17.10.2012